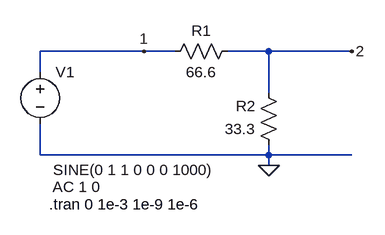
[diagram p0: schematic divisor_resistivo.asc]
divisor_resistivo.asc, the LTspice schematic file:
Version 4
SHEET 1 880 680
WIRE 48 144 -112 144
WIRE 96 144 48 144
WIRE 240 144 176 144
WIRE 368 144 240 144
WIRE -112 176 -112 144
WIRE 240 208 240 144
WIRE -112 304 -112 256
WIRE 240 304 240 288
WIRE 240 304 -112 304
WIRE 368 304 240 304
WIRE 240 320 240 304
FLAG 240 320 0
FLAG 48 144 1
FLAG 368 144 2
SYMBOL res 192 128 R90
WINDOW 0 0 56 VBottom 2
WINDOW 3 32 56 VTop 2
SYMATTR InstName R1
SYMATTR Value 66.6
SYMBOL res 256 304 R180
WINDOW 0 36 76 Left 2
WINDOW 3 36 40 Left 2
SYMATTR InstName R2
SYMATTR Value 33.3
SYMBOL voltage -112 160 R0
WINDOW 3 20 167 Left 2
WINDOW 123 19 193 Left 2
WINDOW 39 0 0 Left 0
SYMATTR InstName V1
SYMATTR Value SINE(0 1 1 0 0 0 1000)
SYMATTR Value2 AC 1 0
TEXT -98 380 Left 2 !.tran 0 1e-3 1e-9 1e-6

The netlist it stands for:
* divisor_resistivo.asc
R1 2 1 66.6
R2 0 2 33.3
V1 1 0 SINE(0 1 1 0 0 0 1000) AC 1 0
.tran 0 1e-3 1e-9 1e-6
.backanno
.end